# EAGLE schematic test (EAGLE 9.3.1)
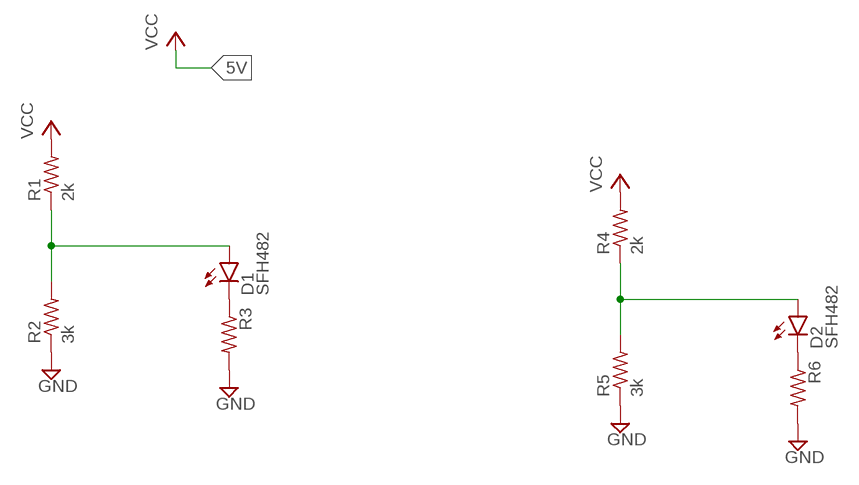
[diagram p0: schematic, sheet 1]

## Parts
D1  SFH482  [SFH482]
D2  SFH482  [SFH482]
R1  2k  R-US_0204/7  [0204/7]
R2  3k  R-US_0204/7  [0204/7]
R3  R-US_0204/7  [0204/7]
R4  2k  R-US_0204/7  [0204/7]
R5  3k  R-US_0204/7  [0204/7]
R6  R-US_0204/7  [0204/7]

## Nets
GND: R2.1 R3.2 R5.1 R6.2
N$1: D1.K(C) R3.1
N$2: D1.A R1.1 R2.2
N$3: D2.K(C) R6.1
N$4: D2.A R4.1 R5.2
VCC: R1.2 R4.2

## Library data of the parts
D1 D2 = led:SFH482: IR LED infrared emitting diode, Infineon
R1-R6 = rcl:R-US_: RESISTOR, American symbol; SPICEPREFIX: R